# EAGLE design AVRUSB (EAGLE 6.4)
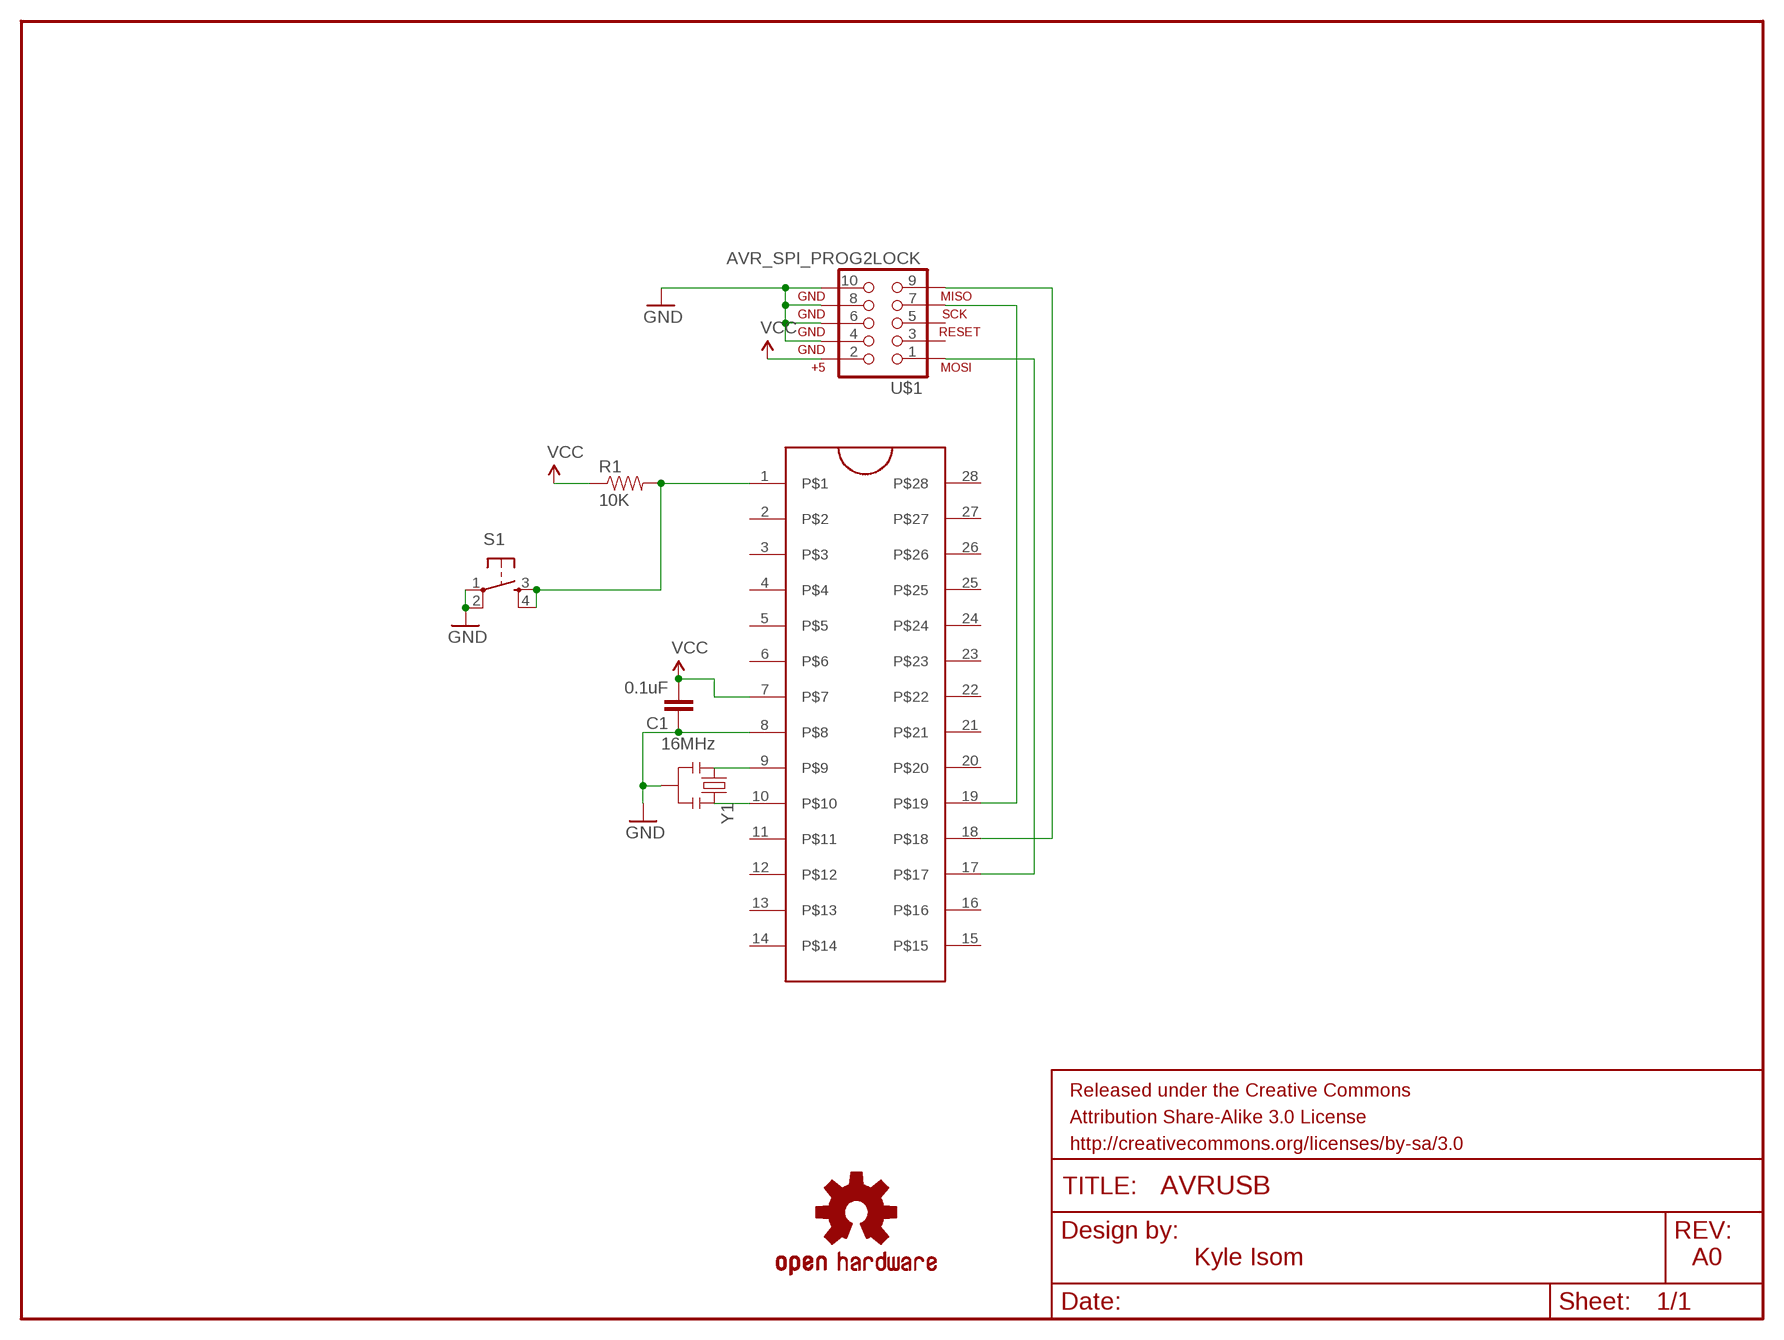
[diagram p0: schematic, sheet 1]

## Parts
C1  0.1uF  CAPPTH  [CAP-PTH-SMALL]
FRAME1  FRAME-LETTER  [CREATIVE_COMMONS]
LOGO1  OSHW-LOGOM  [OSHW-LOGO-M]
R1  10K  RESISTORPTH-1/4W  [AXIAL-0.4]
S1  TAC_SWITCHPTH  [TACTILE-PTH]
U$1  AVR_SPI_PROG2LOCK  [2X5-SHROUDED_LOCK]
U$2  ZIFSOCKET-28-3ZIFFSOCKET-28-3  [DIL28-3-ZIF_SOCKET]
Y1  16MHz  RESONATORPTH  [RESONATOR-PTH]

## Nets
GND: C1.1 S1.1 S1.2 U$1.4 U$1.6 U$1.8 U$1.10 U$2.8 Y1.2
N$2: U$2.9 Y1.1
N$3: U$2.10 Y1.3
N$4: U$1.9 U$2.18
N$5: U$1.1 U$2.17
N$6: U$1.7 U$2.19
N$7: R1.P$2 S1.3 S1.4 U$2.1
VCC: C1.2 R1.P$1 U$1.2 U$2.7
Unconnected: U$1.3 U$1.5 U$2.2 U$2.3 U$2.4 U$2.5 U$2.6 U$2.11 U$2.12 U$2.13 U$2.14 U$2.15 U$2.16 U$2.20 U$2.21 U$2.22 U$2.23 U$2.24 U$2.25 U$2.26 U$2.27 U$2.28

## Notes on the sheet
- Kyle Isom | A0

## Library data of the parts
C1 = SparkFun-Passives:CAP: Capacitor Standard 0603 ceramic capacitor, and 0.1" leaded capacitor.
FRAME1 = Aesthetics:FRAME-LETTER: Schematic Frame Standard 8.5x11 US Letter frame
LOGO1 = SparkFun-Aesthetics:OSHW-LOGO: Open Source Hardware Logo This logo indicates the piece of hardware it is found on incorporates a OSHW license and/or adheres to the definition of open source hardware found here: http://freedomdefined.org/OSHW
R1 = SparkFun-Passives:RESISTOR: Resistor Basic schematic elements and footprints for 0603, 1206, and PTH resistors.
S1 = SparkFun-Electromechanical:TAC_SWITCH: Momentary Switch Button commonly used for reset or general input. Spark Fun Electronics SKU : COM-00097 SMT- SWCH-08247
U$1 = SparkFun-Connectors:AVR_SPI_PROG2: AVR 10-pin ICSP Header This is the standard AVR In Circuit Serial Programming header. Minimal, but includes pin one indicator. Works with standard Olimex programmers. Also look for the 6-pin reduced version. Spark Fun Electronics SKU: PRT-00778
U$2 = SparkFun-Connectors:ZIFSOCKET-28-3: Lever-action ZIF socket for 28-pin ICs
Y1 = SparkFun-FreqCtrl:RESONATOR: Resonator Small SMD resonator. Used, eg, on the Arduino Pro/ Pro Mini boards. 8MHz- XTAL-08895 16MHz- XTAL-08900

## Board
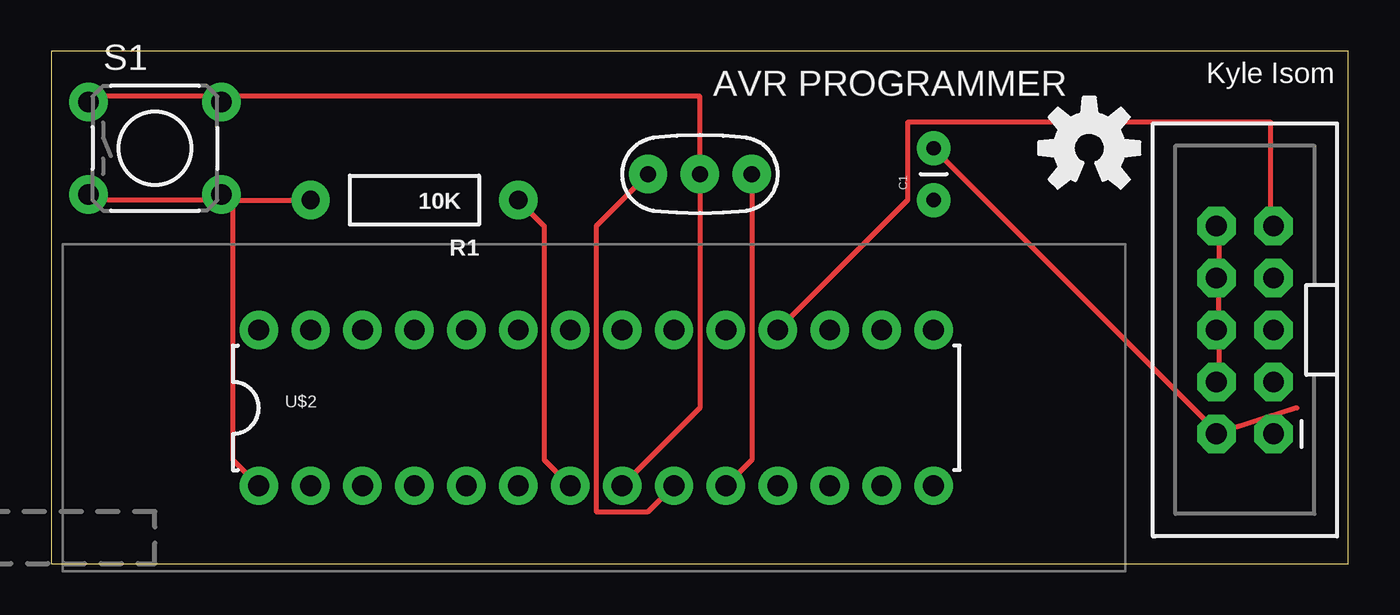
[diagram p1: board, top side]
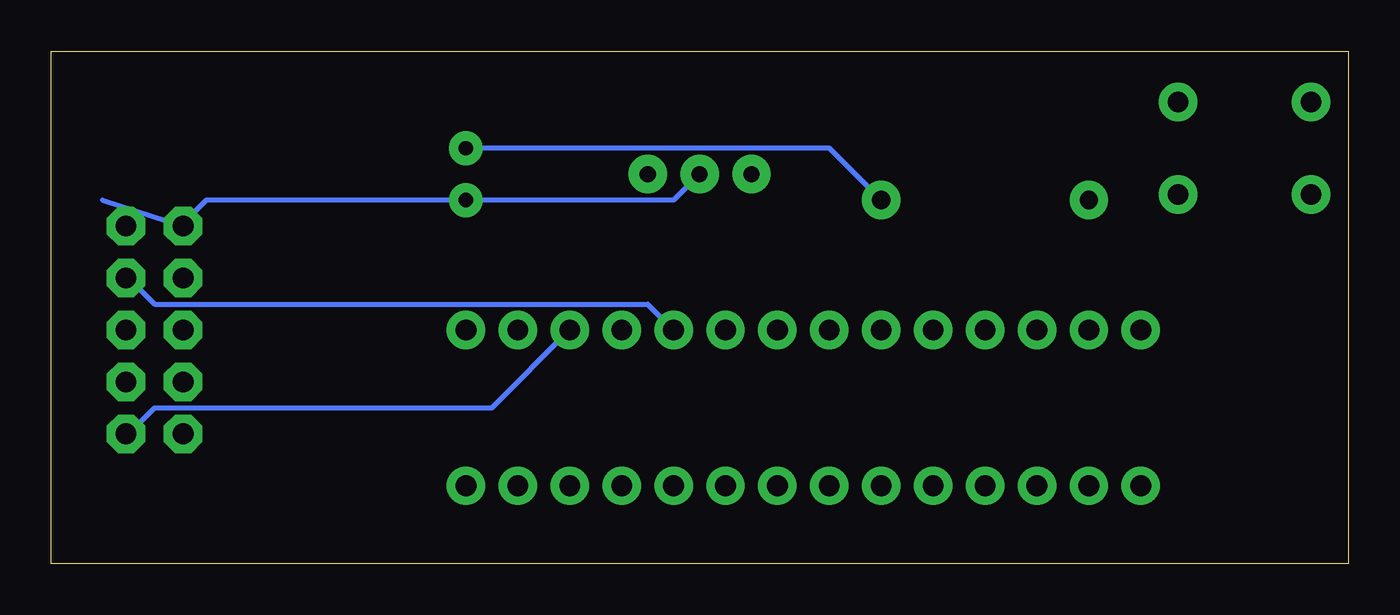
[diagram p2: board, bottom side, seen from below]

Size 63.48 x 25.07 mm. Coordinates in mm from the lower left corner, seen from the top.
Outline: 0,0 63.48,0 63.48,25.07 0,25.07 0,0
Copper layers (1*16): Top 0.035mm / dielectric 1.5mm / Bottom 0.035mm
Design rules "default": minimum track width 10mil, minimum drill 24mil, track to track 8mil, track to pad 8mil, pad to pad 8mil, via to via 8mil, smd to smd 8mil, copper to edge 40mil, drill to drill 8mil, minimum pad ring 10mil, minimum via ring 8mil, stop-mask expansion 4mil, vias tented up to drill 0mil, thermal gap 10mil

### Footprints (pad centres in the part's own frame; a part is rotated, then mirrored left to right if it is on the bottom)
CAP-PTH-SMALL = drill 0.7 pad 1.651: 1 0,0; 2 2.54,0
AXIAL-0.4 = drill 0.9 pad 1.88: P$1 -5.08,0; P$2 5.08,0
TACTILE-PTH = drill 1.016 pad 1.88: 1 -3.251,2.261; 2 3.251,2.261; 3 -3.251,-2.261; 4 3.251,-2.261
2X5-SHROUDED_LOCK = drill 1.016 pad 1.88 octagon: 1 -1.397,5.08; 2 1.397,5.08; 3 -1.397,2.54; 4 1.397,2.54; 5 -1.397,0; 6 1.397,0; 7 -1.397,-2.54; 8 1.397,-2.54; 9 -1.397,-5.08; 10 1.397,-5.08
DIL28-3-ZIF_SOCKET = drill 1.016 pad 1.88: 1 -16.51,-3.81; 2 -13.97,-3.81; 3 -11.43,-3.81; 4 -8.89,-3.81; 5 -6.35,-3.81; 6 -3.81,-3.81; 7 -1.27,-3.81; 8 1.27,-3.81; 9 3.81,-3.81; 10 6.35,-3.81; 11 8.89,-3.81; 12 11.43,-3.81; 13 13.97,-3.81; 14 16.51,-3.81; 15 16.51,3.81; 16 13.97,3.81; 17 11.43,3.81; 18 8.89,3.81; 19 6.35,3.81; 20 3.81,3.81; 21 1.27,3.81; 22 -1.27,3.81; 23 -3.81,3.81; 24 -6.35,3.81; 25 -8.89,3.81; 26 -11.43,3.81; 27 -13.97,3.81; 28 -16.51,3.81
RESONATOR-PTH = drill 0.8 pad 1.88: 1 -2.54,0; 2 0,0; 3 2.54,0

### Placement (x,y rotation side)
C1  43.18,17.78 90 top
FRAME1  -8.89,-11.43 0 top  (outside the outline)
LOGO1  -7.62,-15.24 0 top  (outside the outline)
R1  17.78,17.78 180 top
S1  5.08,20.32 0 top
U$1  58.42,11.43 180 top
U$2  26.67,7.62 0 top
U$3  [OSHW-LOGO-M]  50.8,20.32 0 top
Y1  31.75,19.05 0 top

### Tracks (layer width: path | path; a pad name or v marks a point on that pad's centre or on a via)
GND
  Top 0.254: S1.1 2.54,22.86 7.62,22.86 S1.2 8.89,22.86 31.75,22.86 Y1.2 31.75,7.62 U$2.8 | 57.15,13.97 57.15,16.51 U$1.10 | 57.15,11.43 57.15,8.89 U$1.4 | 57.15,11.43 57.15,13.97 | 57.15,13.97 U$1.8 | 57.15,11.43 U$1.6
  Bottom 0.254: 60.96,17.78 U$1.10 57.15,16.51 55.88,17.78 C1.1 33.02,17.78 Y1.2
N$2
  Top 0.254: U$2.9 29.21,2.54 26.67,2.54 26.67,16.51 Y1.1
N$3
  Top 0.254: U$2.10 34.29,5.08 Y1.3
N$4
  Top 0.254: U$2.18 41.91,17.78 41.91,21.59 59.69,21.59 59.69,16.51 U$1.9
N$5
  Bottom 0.254: U$2.17 41.91,7.62 58.42,7.62 59.69,6.35 U$1.1
N$6
  Bottom 0.254: U$2.19 34.29,12.7 58.42,12.7 59.69,13.97 U$1.7
N$7
  Top 0.254: S1.3 2.54,17.78 7.62,17.78 S1.4 8.89,17.78 | U$2.1 8.89,5.08 8.89,17.78 | 8.89,17.78 R1.P$2
VCC
  Top 0.254: U$2.7 24.13,5.08 24.13,16.51 R1.P$1 | 60.96,7.62 U$1.2 57.15,6.35 C1.2
  Bottom 0.254: C1.2 25.4,20.32 R1.P$1

### Text on the board
tPlace: AVR PROGRAMMER | Kyle Isom